# Altium schematic sheet Sheet_1_.schdoc
size 160 x 83 mm
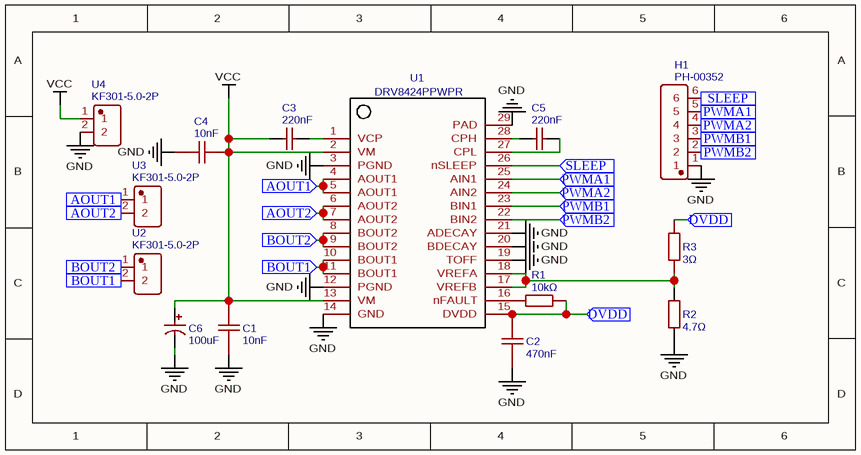
[diagram p0: Sheet_1_.schdoc]

## Parts
C1  10nF  [C0805]
C2  470nF  [C0805]
C3  220nF  [C0805]
C4  10nF  [C0805]
C5  220nF  [C0805]
C6  100uF  [CAP-SMD_BD10.0-L10.3-W10.3-FD]
H1  PH-00352  [HDR-TH_6P-P2.00-V-M]
R1  10kΩ  [R0805]
R2  4.7Ω  [R0805]
R3  3Ω  [R0805]
U1  DRV8424PPWPR  [TSSOP_28_POWERPAD]
U2  KF301-5.0-2P  [CONN-TH_P5.00_KF301-5.0-2P]
U3  KF301-5.0-2P  [CONN-TH_P5.00_KF301-5.0-2P]
U4  KF301-5.0-2P  [CONN-TH_P5.00_KF301-5.0-2P]

## Ports
AOUT1 (in), AOUT2 (in), BOUT1 (in), BOUT2 (in), DVDD (in), PWMA1 (in), PWMA2 (in), PWMB1 (in), PWMB2 (in), SLEEP (in)

## Nets
GND: C1.2 C2.2 C4.2 C6.2 H1.1 R2.1 U1.3(PGND) U1.12(PGND) U1.14(GND) U1.19(TOFF) U1.20(BDECAY) U1.21(ADECAY) U1.29(PAD) U4.2
VCC: C1.1 C3.1 C4.1 C6.1 U1.2(VM) U1.13(VM) U4.1
AOUT1: U1.4(AOUT1) U1.5(AOUT1) U3.1 ; port AOUT1
AOUT2: U1.6(AOUT2) U1.7(AOUT2) U3.2 ; port AOUT2
BOUT1: U1.10(BOUT1) U1.11(BOUT1) U2.2 ; port BOUT1
BOUT2: U1.8(BOUT2) U1.9(BOUT2) U2.1 ; port BOUT2
DVDD: C2.1 R1.2 R3.1 U1.15(DVDD) ; port DVDD
PWMA1: H1.5 U1.25(AIN1) ; port PWMA1
PWMA2: H1.4 U1.24(AIN2) ; port PWMA2
PWMB1: H1.3 U1.23(BIN1) ; port PWMB1
PWMB2: H1.2 U1.22(BIN2) ; port PWMB2
SLEEP: H1.6 U1.26(nSLEEP) ; port SLEEP
NetC3_2: C3.2 U1.1(VCP)
NetC5_1: C5.1 U1.27(CPL)
NetC5_2: C5.2 U1.28(CPH)
NetR1_1: R1.1 U1.16(nFAULT)
NetR2_2: R2.2 R3.2 U1.17(VREFB) U1.18(VREFA)

## Library data of the parts
C1 C4 = 10nF: BOM_Manufacturer: YAGEO; BOM_Manufacturer Part: CC0805KRX7R9BB103; nameAlias: Capacitance; BOM_Supplier: LCSC; BOM_Supplier Part: C83170; BOM_JLCPCB Part Class: Extended Part; spicePre: C; spiceSymbolName: CC0805KRX7R9BB103
C2 = 470nF: BOM_Manufacturer: YAGEO; BOM_Manufacturer Part: CC0805JKX7R7BB474; nameAlias: Capacitance; Contributor: LCSC; BOM_Supplier: LCSC; BOM_Supplier Part: C520079; spicePre: C; spiceSymbolName: CC0805JKX7R7BB474
C3 C5 = 220nF: BOM_Manufacturer: YAGEO; BOM_Manufacturer Part: CC0805KRX7R8BB224; nameAlias: Capacitance; BOM_Supplier: LCSC; BOM_Supplier Part: C107139; BOM_JLCPCB Part Class: Extended Part; spicePre: C; spiceSymbolName: CC0805KRX7R8BB224
C6 = 100uF: BOM_Manufacturer: HONOR; BOM_Manufacturer Part: RVT1J101M1010; nameAlias: Capacitance; BOM_Supplier: LCSC; BOM_Supplier Part: C28241; BOM_JLCPCB Part Class: Extended Part; spicePre: C; spiceSymbolName: RVT1J101M1010
H1 = PH-00352: BOM_Manufacturer: Liansheng(连盛); Contributor: LCSC; BOM_Supplier: LCSC; BOM_Supplier Part: C2685156; BOM_Manufacturer Part: PH-00352; spicePre: H; spiceSymbolName: PH-00352
R1 = 10kΩ: BOM_Manufacturer: KOA Speer Elec; BOM_Manufacturer Part: RN73H2ATTD1002B25; Resistance (Ohms): 10K; nameAlias: Resistance; Contributor: LCSC; BOM_Supplier: LCSC; BOM_Supplier Part: C186277; BOM_JLCPCB Part Class: Extended Part; spicePre: R; spiceSymbolName: RN73H2ATTD1002B25
R2 = 4.7Ω: BOM_Manufacturer: LIZ; BOM_Manufacturer Part: CR0805F84R70G; nameAlias: Resistance; Resistance (Ohms): 4.7; BOM_Supplier: LCSC; BOM_Supplier Part: C101766; BOM_JLCPCB Part Class: Extended Part; spicePre: R; spiceSymbolName: CR0805F84R70G
R3 = 3Ω: BOM_Manufacturer: ResistorToday; BOM_Manufacturer Part: HPCR0805F3R00K9; Resistance (Ohms): 3; Contributor: LCSC; nameAlias: Resistance; BOM_Supplier: LCSC; BOM_Supplier Part: C363264; BOM_JLCPCB Part Class: Extended Part; spicePre: R; spiceSymbolName: HPCR0805F3R00K9
U1 = DRV8424PPWPR: Contributor: 吳東燁; spicePre: U; spiceSymbolName: DRV8424PPWPR
U2-U4 = KF301-5.0-2P: BOM_Manufacturer: Cixi Kefa Elec; Contributor: LCSC; BOM_Supplier: LCSC; BOM_Supplier Part: C474881; BOM_Manufacturer Part: KF301-5.0-2P; BOM_JLCPCB Part Class: Extended Part; spicePre: U; spiceSymbolName: KF301-5.0-2P